# Altium schematic sheet rp2040_core.SchDoc
size A; SheetNumber: 1; SheetTotal: 3
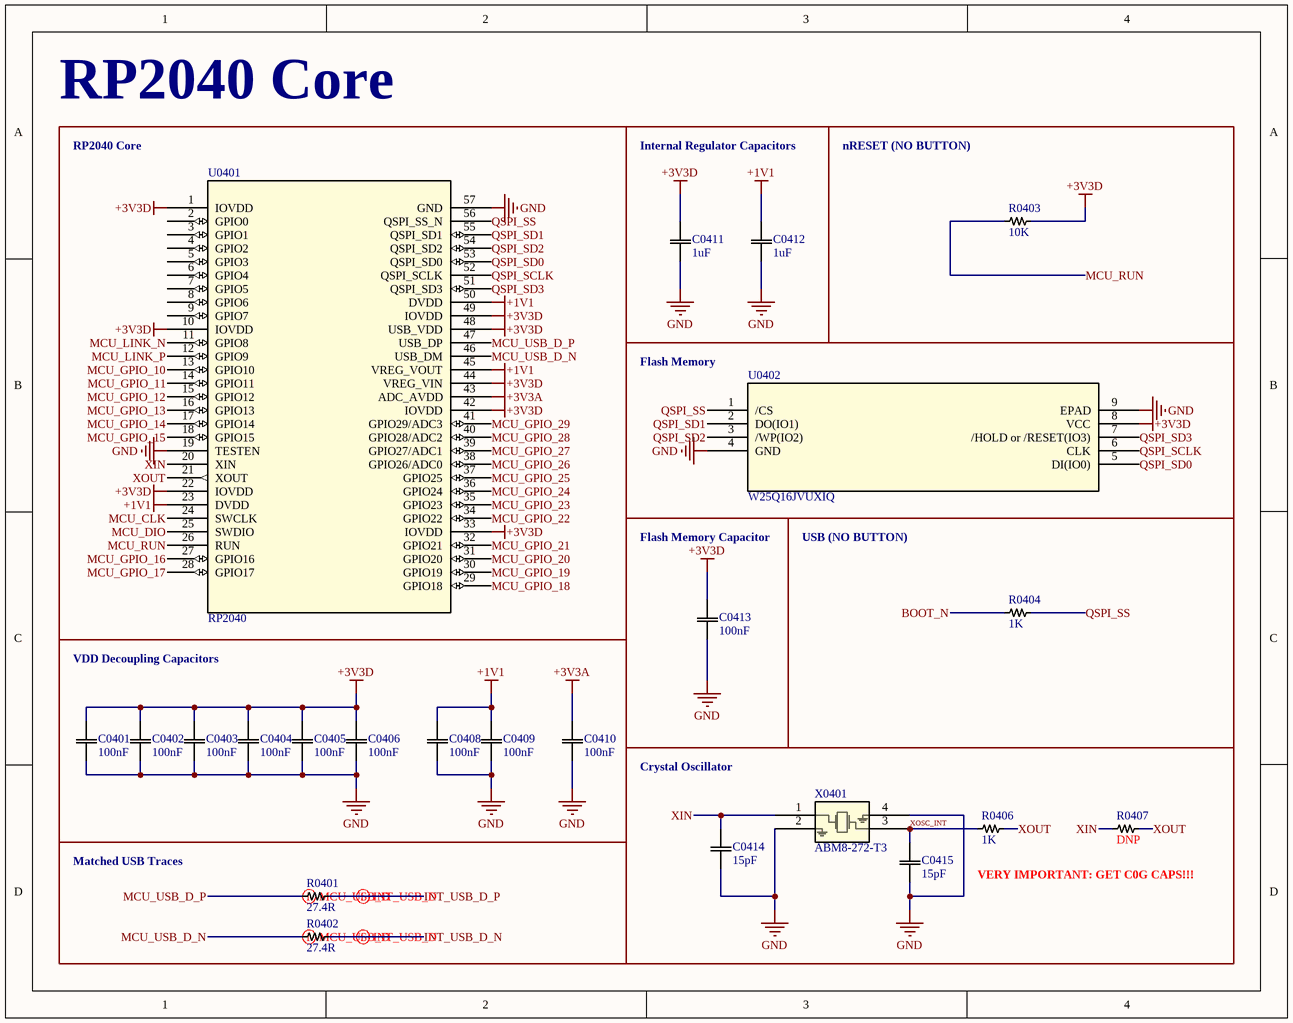
[diagram p0: rp2040_core.SchDoc]

## Parts
C0401  100nF  [CAPC10555_55N_KEM]
C0402  100nF  [CAPC10555_55N_KEM]
C0403  100nF  [CAPC10555_55N_KEM]
C0404  100nF  [CAPC10555_55N_KEM]
C0405  100nF  [CAPC10555_55N_KEM]
C0406  100nF  [CAPC10555_55N_KEM]
C0408  100nF  [CAPC10555_55N_KEM]
C0409  100nF  [CAPC10555_55N_KEM]
C0410  100nF  [CAPC10555_55N_KEM]
C0411  1uF  [CAPC10555_55N_KEM]
C0412  1uF  [CAPC10555_55N_KEM]
C0413  100nF  [CAPC10555_55N_KEM]
C0414  15pF  [CAPC10555_55N_KEM]
C0415  15pF  [CAPC10555_55N_KEM]
R0401  27.4R  [RES0402_CPF_TYCO_TYC]
R0402  27.4R  [RES0402_CPF_TYCO_TYC]
R0403  10K  [RES0402_CPF_TYCO_TYC]
R0404  1K  [RES0402_CPF_TYCO_TYC]
R0406  1K  [RES0402_CPF_TYCO_TYC]
R0407  DNP  [RES0402_CPF_TYCO_TYC]
U0401  RP2040  [IC57_RP2040]
U0402  W25Q16JVUXIQ  [W25Q16JVUXIQ_WIN]
X0401  ABM8-272-T3  [ABM8-272-T3_ABR]

## Blocks framed on the sheet
RP2040 Core: U0401
Internal Regulator Capacitors: C0411 C0412
nRESET (NO BUTTON): R0403
Flash Memory: U0402
Flash Memory Capacitor: C0413
USB (NO BUTTON): R0404
VDD Decoupling Capacitors: C0401 C0402 C0403 C0404 C0405 C0406 C0408 C0409 C0410
Matched USB Traces: R0401 R0402

## Nets
+1V1: C0408.2 C0409.2 C0412.2 U0401.23(DVDD) U0401.45(VREG_VOUT) U0401.50(DVDD)
+3V3A: C0410.2 U0401.43(ADC_AVDD)
+3V3D: C0401.2 C0402.2 C0403.2 C0404.2 C0405.2 C0406.2 C0411.2 C0413.2 R0403.1 U0401.1(IOVDD) U0401.10(IOVDD) U0401.22(IOVDD) U0401.33(IOVDD) U0401.42(IOVDD) U0401.44(VREG_VIN) U0401.48(USB_VDD) U0401.49(IOVDD) U0402.8(VCC)
GND: C0401.1 C0402.1 C0403.1 C0404.1 C0405.1 C0406.1 C0408.1 C0409.1 C0410.1 C0411.1 C0412.1 C0413.1 C0414.2 C0415.1 U0401.19(TESTEN) U0401.57(GND) U0402.4(GND) U0402.9(EPAD) X0401.2 X0401.4
BOOT_N: R0404.2
INT_USB_D_N: R0402.1
INT_USB_D_P: R0401.1
MCU_CLK: U0401.24(SWCLK)
MCU_DIO: U0401.25(SWDIO)
MCU_GPIO_10: U0401.13(GPIO10)
MCU_GPIO_11: U0401.14(GPIO11)
MCU_GPIO_12: U0401.15(GPIO12)
MCU_GPIO_13: U0401.16(GPIO13)
MCU_GPIO_14: U0401.17(GPIO14)
MCU_GPIO_15: U0401.18(GPIO15)
MCU_GPIO_16: U0401.27(GPIO16)
MCU_GPIO_17: U0401.28(GPIO17)
MCU_GPIO_18: U0401.29(GPIO18)
MCU_GPIO_19: U0401.30(GPIO19)
MCU_GPIO_20: U0401.31(GPIO20)
MCU_GPIO_21: U0401.32(GPIO21)
MCU_GPIO_22: U0401.34(GPIO22)
MCU_GPIO_23: U0401.35(GPIO23)
MCU_GPIO_24: U0401.36(GPIO24)
MCU_GPIO_25: U0401.37(GPIO25)
MCU_GPIO_26: U0401.38(GPIO26/ADC0)
MCU_GPIO_27: U0401.39(GPIO27/ADC1)
MCU_GPIO_28: U0401.40(GPIO28/ADC2)
MCU_GPIO_29: U0401.41(GPIO29/ADC3)
MCU_LINK_N: U0401.11(GPIO8)
MCU_LINK_P: U0401.12(GPIO9)
MCU_RUN: R0403.2 U0401.26(RUN)
MCU_USB_D_N: R0402.2 U0401.46(USB_DM)
MCU_USB_D_P: R0401.2 U0401.47(USB_DP)
QSPI_SCLK: U0401.52(QSPI_SCLK) U0402.6(CLK)
QSPI_SD0: U0401.53(QSPI_SD0) U0402.5(DI(IO0))
QSPI_SD1: U0401.55(QSPI_SD1) U0402.2(DO(IO1))
QSPI_SD2: U0401.54(QSPI_SD2) U0402.3(/WP(IO2))
QSPI_SD3: U0401.51(QSPI_SD3) U0402.7(/HOLD_or_/RESET(IO3))
QSPI_SS: R0404.1 U0401.56(QSPI_SS_N) U0402.1(/CS)
XIN: C0414.1 R0407.1 U0401.20(XIN) X0401.1
XOSC_INT: C0415.2 R0406.1 X0401.3
XOUT: R0406.2 R0407.2 U0401.21(XOUT)

Not connected (* = marked no-connect by the designer): U0401 2(GPIO0) 3(GPIO1) 4(GPIO2) 5(GPIO3) 6(GPIO4) 7(GPIO5) 8(GPIO6) 9(GPIO7)

## Layout directives
differential pair: INT_USB_D_N, INT_USB_D_P, MCU_USB_D_N, MCU_USB_D_P

## Notes on the sheet
- RP2040 Core
- Crystal Oscillator
- VERY IMPORTANT: GET C0G CAPS!!!

## Library data of the parts
C0401 C0402 C0403 C0404 C0405 C0406 C0408 C0409 C0410 C0411 C0412 C0413 C0414 C0415 = C0402: SMD Comm X7R, Ceramic, SMD, MLCC, Temperature Stable, 0402; Manufacturer_Name: Kemet; Manufacturer_Part_Number: C0402C104K4RACTU; Copyright: Copyright (C) 2025 Ultra Librarian. All rights reserved.; Datasheet: https://content.kemet.com/datasheets/KEM_C1002_X7R_SMD.pdf
R0401 R0402 R0403 R0404 R0406 R0407 = R0402: CPF 0402 RL; Manufacturer_Name: TE Connectivity; Manufacturer_Part_Number: CPF0402B33RE1; Copyright: Copyright (C) 2025 Ultra Librarian. All rights reserved.; Datasheet: https://www.te.com/commerce/DocumentDelivery/DDEController?Action=srchrtrv&DocNm=1773200&DocType=Data+Sheet&DocLang=English&PartCntxt=1-1879208-3&DocFormat=pdf
U0401 = RP2040: No Description Available; Manufacturer_Name: Raspberry Pi; Copyright: Copyright (C) 2025 Ultra Librarian. All rights reserved.; Manufacturer_Part_Number: RP2040; RefDes: RefDes; Type: Type
U0402 = W25Q16JVUXIQ: No Description Available; Manufacturer_Name: Winbond; Copyright: Copyright (C) 2025 Ultra Librarian. All rights reserved.; Manufacturer_Part_Number: W25Q16JVUXIQ; RefDes: RefDes; Type: Type
X0401 = ABM8-272-T3: No Description Available; Manufacturer_Name: Abracon; Type: Crystals; Copyright: Copyright (C) 2025 Ultra Librarian. All rights reserved.; Manufacturer_Part_Number: ABM8-272-T3; RefDes: RefDes